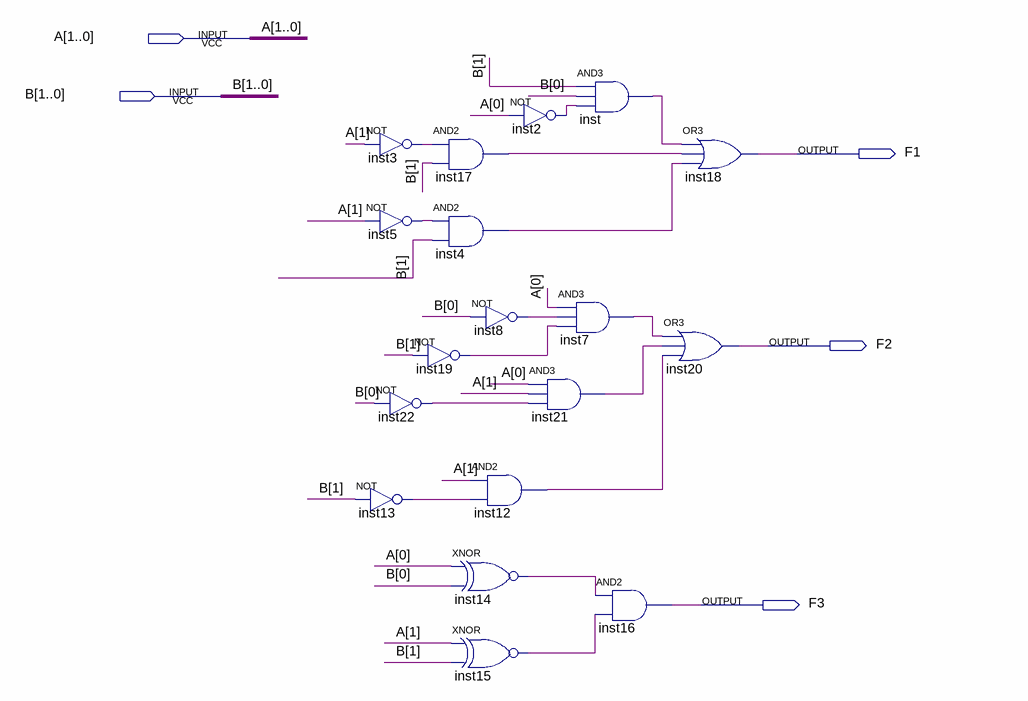
[diagram p0: schematic sheet]
// Quartus schematic comparator_circuit.bdf as structural Verilog: 18 symbols, 5 pins
module comparator_circuit (
  input  [1:0] A,
  input  [1:0] B,
  output F1,
  output F2,
  output F3
);

  wire inst2_out, inst3_out, inst4_out, inst5_out, inst7_out, inst8_out, inst12_out, inst13_out, inst14_out,
       inst15_out, inst17_out, inst19_out, inst21_out, inst22_out, inst_out;

  not inst3 (inst3_out, A[1]);
  not inst5 (inst5_out, A[1]);
  not inst22 (inst22_out, B[0]);
  not inst13 (inst13_out, B[1]);
  and inst17 (inst17_out, inst3_out, B[1]);
  and inst4 (inst4_out, inst5_out, B[1]);
  not inst8 (inst8_out, B[0]);
  not inst19 (inst19_out, B[1]);
  and inst12 (inst12_out, A[1], inst13_out);
  xnor inst14 (inst14_out, A[0], B[0]);
  xnor inst15 (inst15_out, A[1], B[1]);
  not inst2 (inst2_out, A[0]);
  and inst21 (inst21_out, A[0], A[1], inst22_out);
  and inst (inst_out, B[1], B[0], inst2_out);
  and inst7 (inst7_out, A[0], inst8_out, inst19_out);
  and inst16 (F3, inst14_out, inst15_out);
  or inst18 (F1, inst_out, inst17_out, inst4_out);
  or inst20 (F2, inst7_out, inst21_out, inst12_out);
endmodule
